# EasyEDA Pro project 16V2_EDA.eprj

# Schematic Schematic2
Board Name: Board1; Create Date: 2024-11-21; Page Name: P1; Project Name: 16V2_EDA; Schematic Name: Schematic2; Update Date: 2024-12-05; Company: 嘉立创EDA; Page Size: A4; Version: V1.0
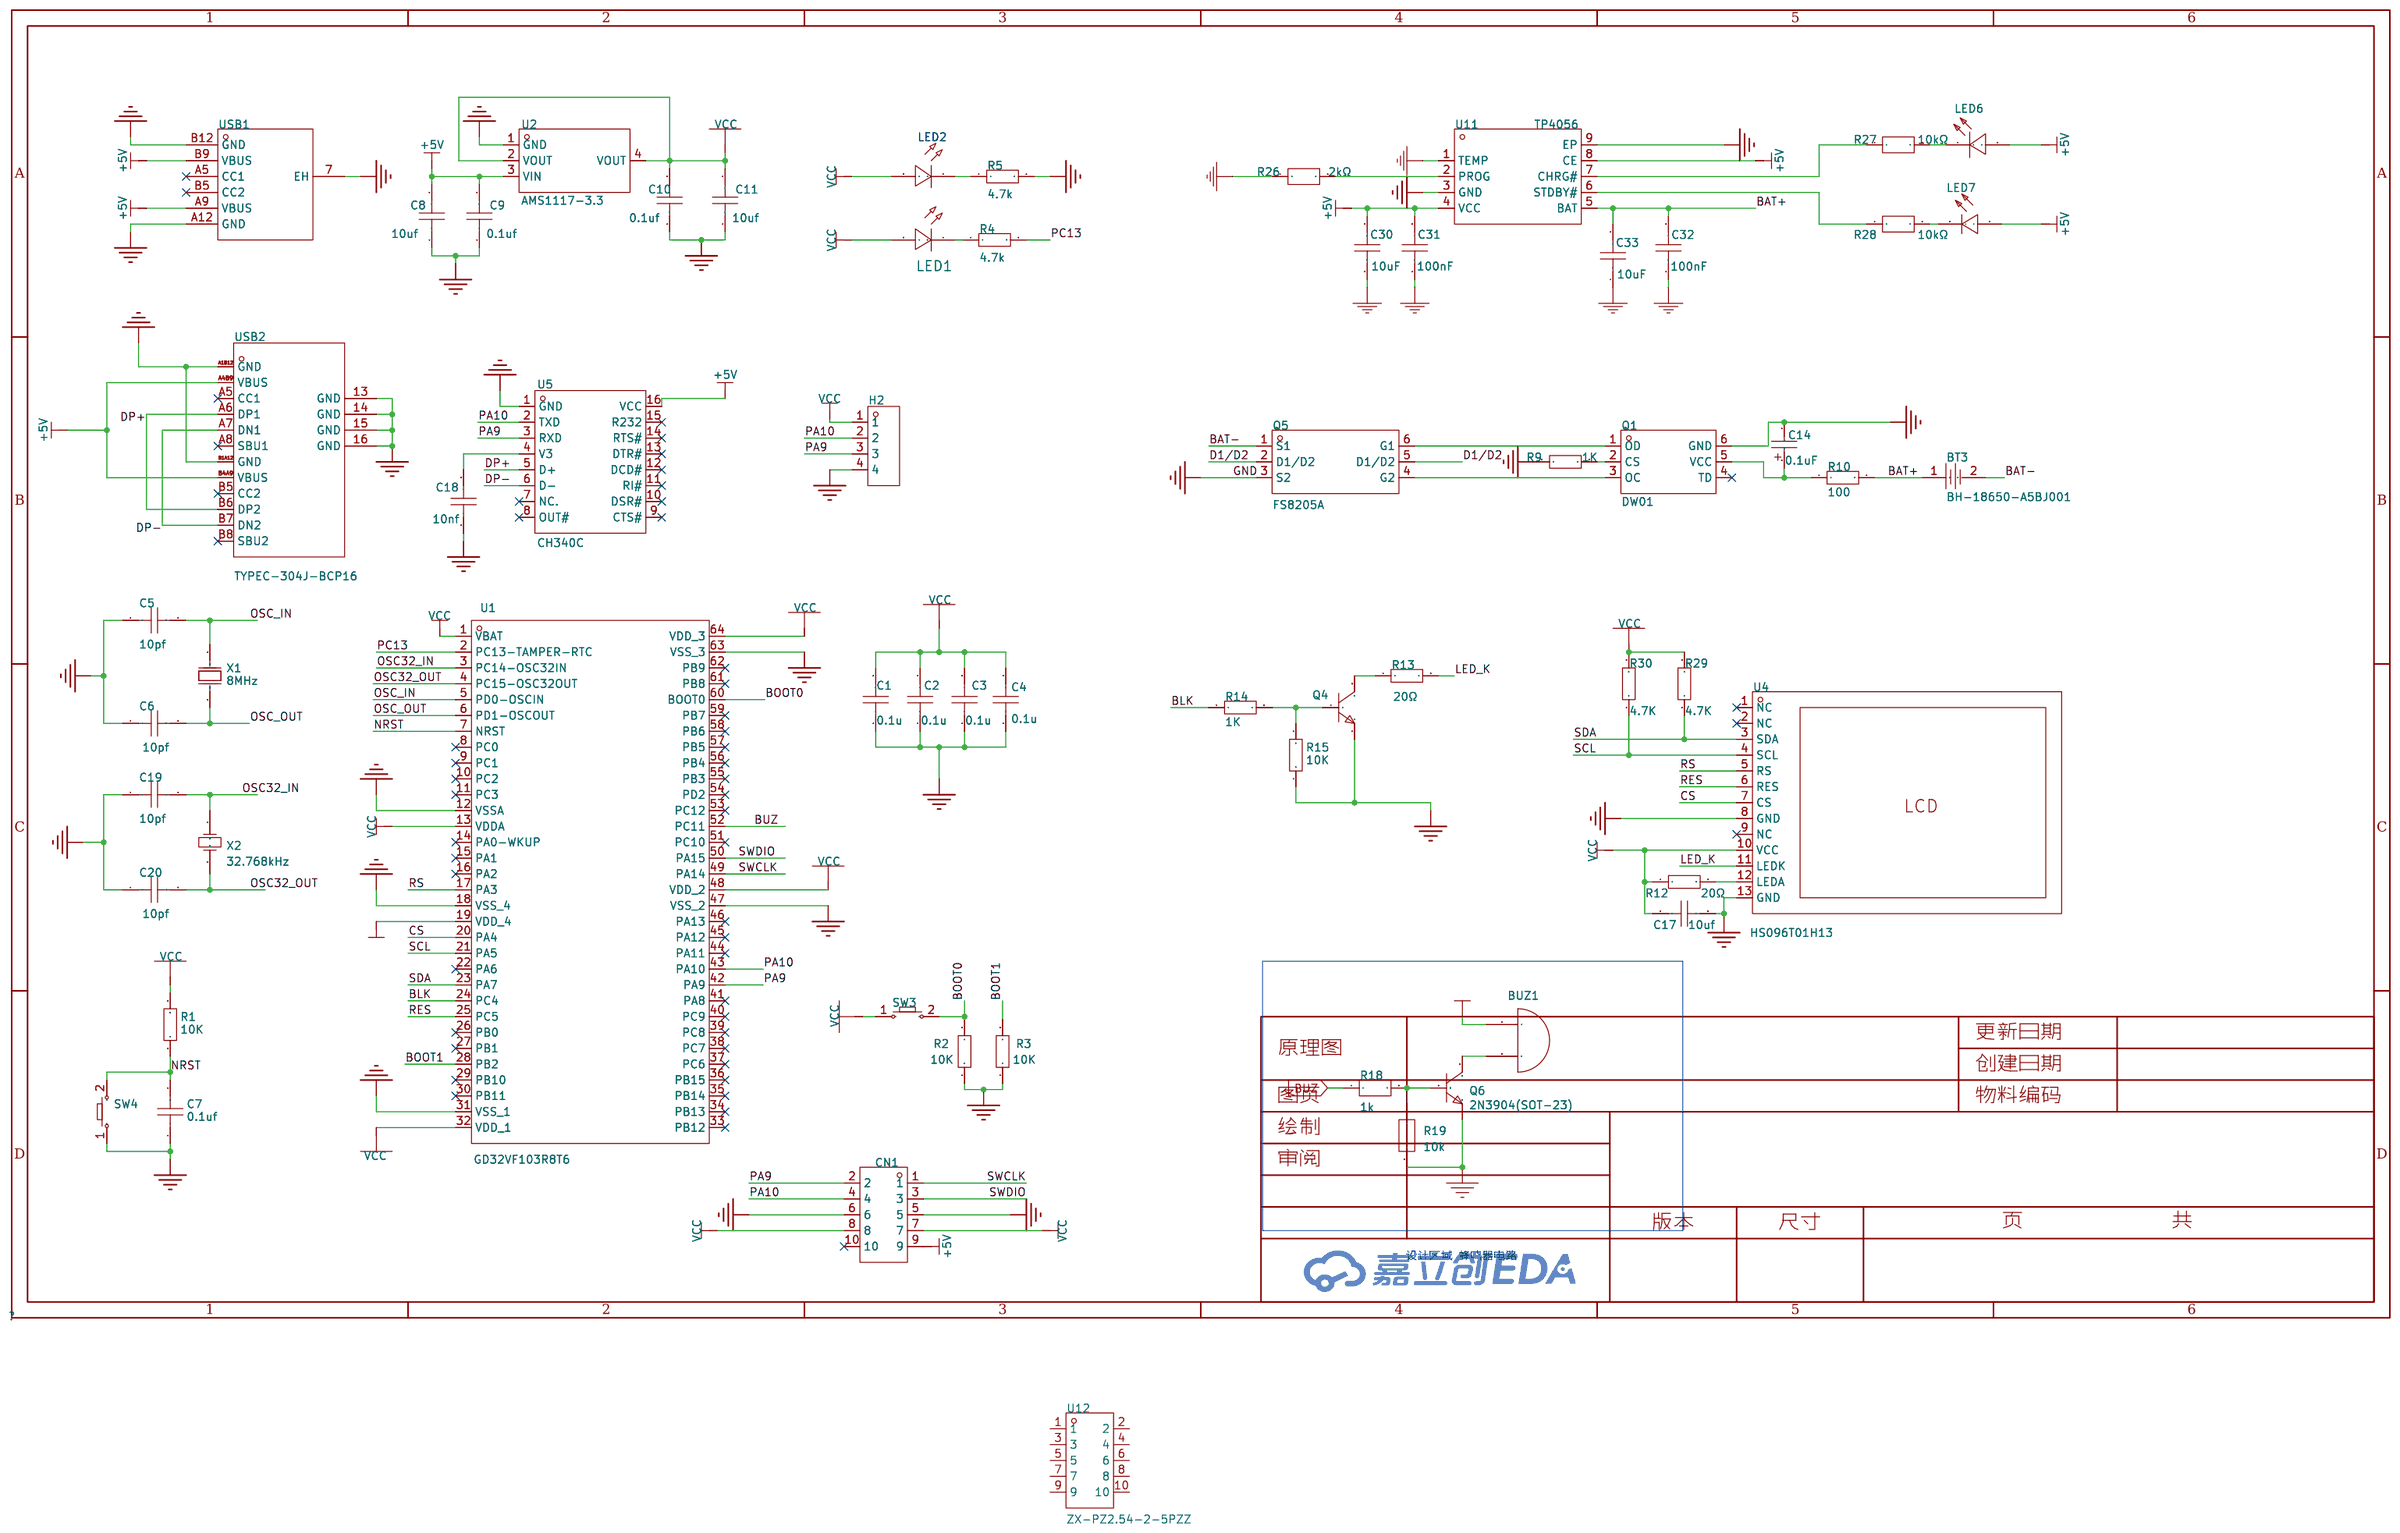
[diagram p0: schematic sheet]

## Parts
BT3  BH-18650-A5BJ001  [BAT-SMD_CR1220-2ZX]
BUZ1  BUZ1  [BUZ]
C1  0.1u  [C0603]
C2  0.1u  [C0603]
C3  0.1u  [C0603]
C4  0.1u  [C0603]
C5  10pf  [C0603]
C6  10pf  [C0603]
C7  0.1uf  [C0603]
C8  10uf  [C0603]
C9  0.1uf  [C0603]
C10  0.1uf  [C0603]
C11  10uf  [C0603]
C14  0.1uF  [C0603]
C17  10uf  [C0603]
C18  10nf  [C0603]
C19  10pf  [C0603]
C20  10pf  [C0603]
C30  10uF  [C0603]
C31  100nF  [C0603]
C32  100nF  [C0603]
C33  10uF  [C0603]
CN1  ZX-PZ2.54-2-5PZZ  [HDR-TH_10P-P2.54-V-M-R2-C5-S2.54]
H2  2.54-1*4P反弯排针  [HDR-TH_4P-P2.54-H-M-W10.4]
LED1  -  [LED_0603]
LED2  -  [LED_0603]
LED6  KT-0603R  [LED0603-RD]
LED7  NCD0603B1  [LED0603-RD]
Q1  DW01  [SOT-23-6_L2.9-W1.6-P0.95-LS2.8-BR]
Q4  -  [S8050_SOT-23]
Q5  FS8205A  [SOT-23-6_L2.9-W1.6-P0.95-LS2.8-BR]
Q6  2N3904(SOT-23)  [sot-23-3_l2.9-w1.3-p1.90-ls2.4-br]
R1  10K  [R0603]
R2  10K  [R0603]
R3  10K  [R0603]
R4  4.7k  [R0603]
R5  4.7k  [R0603]
R9  1K  [R0603]
R10  100  [R0603]
R12  20Ω  [R0603]
R13  20Ω  [R0603]
R14  1K  [R0603]
R15  10K  [R0603]
R18  1k  [R0603]
R19  10k  [R0603]
R26  2kΩ  [R0603]
R27  10kΩ  [R0603]
R28  10kΩ  [R0603]
R29  4.7K  [R0603]
R30  4.7K  [R0603]
SW3  -  [Key_SMD_3x4x2]
SW4  -  [Key_SMD_3x4x2]
U1  GD32VF103R8T6  [LQFP-64_L10.0-W10.0-P0.50-LS12.0-BL]
U2  AMS1117-3.3  [SOT-223-3_L6.5-W3.4-P2.30-LS7.0-BR]
U4  HS096T01H13  [LCD-SMD_HS096T01H13]
U5  CH340C  [SOP-16_L10.0-W3.9-P1.27-LS6.0-BL]
U11  TP4056  [esop-8_l4.9-w3.9-p1.27-ls6.0-bl-ep]
U12  ZX-PZ2.54-2-5PZZ  [HDR-TH_10P-P2.54-V-M-R2-C5-S2.54]
USB1  TYPE-C 6P  [TYPE-C-SMD_TYPE-C-6P]
USB2  TYPEC-304J-BCP16  [USB-C-SMD_TYPEC-304J-BCP16]
X1  8MHz  [HC-49S_L10.8-W4.5-P4.88]
X2  32.768kHz  [CRYSTAL-SMD_L3.2-W1.5]

## Library data of the parts
BT3 = BH-18650-A5BJ001: BHNi DIP 适用电池18650电芯//电池底座/卧式DIP 电池盒/电池座 材质：PP  镀镍 ，; Supplier Part: C5383220; Manufacturer: MYOUNG(美阳); Supplier Footprint: 插件; Datasheet: https://atta.szlcsc.com/upload/public/pdf/source/20230321/F45C04DF2D4E00D187312CBE97BD9F67.pdf; Supplier: LCSC
BUZ1 = BUZ1
C1-C11 C17-C20 = CAP_0603: Supplier Footprint: 0603
C14 = C_Ele_SMD_3x5.4mm: Supplier Footprint: SMD,3x5.4mm
C30 C33 = CL21A106KAYNNNE_C15850: 容值:10uF;精度:±10%;额定电压:25V;材质(温度系数):X5R;; LCSC Part Name: 10uF ±10% 25V; Supplier Part: C15850; Manufacturer: SAMSUNG(三星); Manufacturer Part: CL21A106KAYNNNE; Supplier Footprint: 0805; JLCPCB Part Class: Basic Part; Datasheet: https://atta.szlcsc.com/upload/public/pdf/source/20160218/1457707763339.pdf; Supplier: LCSC; Tolerance: ±10%; Voltage Rated: 25V; Temperature Coefficient: X5R
C31 C32 = CC0603KRX7R9BB104: 容值:100nF;精度:±10%;额定电压:50V;材质(温度系数):X7R;; LCSC Part Name: 100nF ±10% 50V; Supplier Part: C14663; Manufacturer: YAGEO(国巨); Supplier Footprint: 0603; JLCPCB Part Class: 基础库; Datasheet: https://atta.szlcsc.com/upload/public/pdf/source/20180910/C282072_33301C7F631E79921B82A8DAC6BCC5B3.pdf; Supplier: LCSC; Tolerance: ±10%; Voltage Rated: 50V; Temperature Coefficient: X7R
CN1 = ZX-PZ2.54-2-5PZZ: 插针结构:2x5P;间距:2.54mm;行距:2.54mm;圆针/方针:方针;安装类型:直插;排数:双排;总PIN位数:10P;额定电流:3A;额定电压:1kV;配合针长度:6mm;塑高:2.5mm;端接针长度:3mm;触头材质:黄铜;触头镀层:金;工作温度范围:-40℃~+105℃;焊接温度(最大值):-;颜色:黑色;; LCSC Part Name: 2x5P 间距:2.54mm 方针 直插; Supplier Part: C7501276; Manufacturer: Megastar(兆星); Supplier Footprint: 插件,P=2.54mm; JLCPCB Part Class: Extended Part; Datasheet: https://atta.szlcsc.com/upload/public/pdf/source/20231122/7DD2FA5A7FDBC10CDDB6051CB6BC6AD1.pdf; Supplier: LCSC; Pin Structure: 2x5P; Pitch: 2.54mm; Row Spacing: 2.54mm; Circluar Pins/Square Pins: 方针; Mounting Type: 直插; Number of Rows: 双排; Number of Pins: 10P; Current Rating (Max): 3A; Voltage Rating (Max): 1kV; Length of Mating Pin: 6mm; Insulation Height: 2.5mm; Length of End Connection Pin: 3mm; Contact Material: 黄铜; Contact Plating: 金; Operating Temperature Range: -40℃~+105℃; Color: 黑色; Check: false
H2 = 2.54-1*4P反弯排针: 插针结构:1x4P;间距:2.54mm;行距:-;圆针/方针:方针;安装类型:弯插;排数:单排;总PIN位数:4P;额定电流:3A;额定电压:-;配合针长度:6mm;塑高:-;端接针长度:-;触头材质:-;触头镀层:-;工作温度范围:-55℃~+105℃;颜色:黑色;; LCSC Part Name: 间距:2.54mm 1x4P 弯插 方针; Supplier Part: C91552; Manufacturer: BOOMELE(博穆精密); Supplier Footprint: 弯插,P=2.54mm; JLCPCB Part Class: 扩展库; Datasheet: https://atta.szlcsc.com/upload/public/pdf/source/20190508/C74252_03DDEC4696EE17172E44B96636392962.pdf; Supplier: LCSC; Pin Structure: 1x4P; Pitch: 2.54mm; Circluar Pins/Square Pins: 方针; Mounting Type: 弯插; Number of Rows: 单排; Number of Pins: 4P; Current Rating (Max): 3A; Length of Mating Pin: 6mm; Operating Temperature Range: -55℃~+105℃; Color: 黑色
LED1 = LED_0603-R: Supplier Footprint: 0603
LED2 = LED_0603-G: Supplier Footprint: 0603
LED6 = KT-0603R: Supplier: LCSC; Manufacturer: KENTO; Supplier Part: C2286; JLCPCB Part Class: Basic Part
LED7 = NCD0603B1: 发光颜色:蓝色;正向电压(VF):2.6V~3.6V;功率:72mW;正向电流:10mA;主波长:463nm~475nm;透镜颜色:无色透明透镜;发光强度:80mcd~220mcd;发光角度:130°;工作温度:-30℃~+85℃;; Supplier Part: C84266; Manufacturer: 国星光电; Supplier Footprint: 0603; JLCPCB Part Class: Extended Part; Datasheet: https://atta.szlcsc.com/upload/public/pdf/source/20200820/C84266_6A3CDBEFA72C6CAD68EDA53474ADAE6C.pdf; Supplier: LCSC; Emitted Color: 蓝色; Forward Voltage (VF): 2.6V~3.6V; Power Dissipation: 72mW; Forward Current: 10mA; Dominant Wavelength: 463nm~475nm; Lens Color: 无色透明透镜; Luminous Intensity: 80mcd~220mcd; Viewing Angle: 130°; Operating Temperature: -30℃~+85℃
Q1 = DW01_C181096: Supplier Part: C181096; Manufacturer: Hottech(合科泰); Supplier Footprint: SOT-23-6; Datasheet: https://atta.szlcsc.com/upload/public/pdf/source/20231007/94AC323C2B651AEA18C7FC8F0156E5A9.pdf; Supplier: LCSC
Q4 = S8050_SOT_NPN: Supplier Footprint: SOT-23
Q5 = FS8205A: 类型:2个N沟道;漏源电压(Vdss):20V;连续漏极电流(Id):6A;功率(Pd):1.5W;导通电阻(RDS(on)@Vgs,Id):19.5mΩ@4.5V,3A;阈值电压(Vgs(th)@Id):700mV@250uA;; LCSC Part Name: 2个N沟道 耐压:20V 电流:6A; Supplier Part: C2830320; Manufacturer: TECH PUBLIC(台舟); Supplier Footprint: SOT-23-6; JLCPCB Part Class: 扩展库; Datasheet: https://atta.szlcsc.com/upload/public/pdf/source/20210810/F53B6D4E8755A1F8E11BAF814CE98E6A.pdf; Supplier: LCSC; Type: 2个N沟道; Drain Source Voltage (Vdss): 20V; Continuous Drain Current (Id): 6A; Power Dissipation (Pd): 1.5W; Drain Source On Resistance (RDS(on)@Vgs,Id): 19.5mΩ@4.5V,3A; Gate Threshold Voltage (Vgs(th)@Id): 700mV@250uA; Total Gate Charge (Qg@Vgs): 5.7nC@10V; Input Capacitance (Ciss@Vds): 466pF@10V; Reverse Transfer Capacitance (Crss@Vds): 58pF@10V; Operating Temperature: -55℃~+150℃@(Tj)
Q6 = 2n3904S-RTK/PS: Supplier: LCSC; Manufacturer: KEC; Supplier Part: C18536; Paste Type: SOT-23
R1-R5 R9 R10 R12-R15 R29 R30 = Res_0603: Supplier Footprint: 0603
R18 = 1k
R19 = 10k
R26 = 0603WAF2001T5E: 电阻类型:厚膜电阻;阻值:2kΩ;精度:±1%;功率:100mW;最大工作电压:75V;温度系数:±100ppm/℃;; LCSC Part Name: 2kΩ ±1% 100mW 厚膜电阻; Supplier Part: C22975; Manufacturer: UNI-ROYAL(厚声); Supplier Footprint: 0603; JLCPCB Part Class: Basic Part; Datasheet: https://atta.szlcsc.com/upload/public/pdf/source/20200306/C422600_1E6D84923E4A46A82E41ADD87F860B5C.pdf; Supplier: LCSC; Type: 厚膜电阻; Tolerance: ±1%; Power(Watts): 100mW; Overload Voltage (Max): 75V; Temperature Coefficient: ±100ppm/℃; Operating Temperature Range: -55℃~+155℃
R27 R28 = 0603WAF1002T5E: 电阻类型:厚膜电阻;阻值:10kΩ;精度:±1%;功率:100mW;最大工作电压:75V;温度系数:±100ppm/℃;; LCSC Part Name: 厚膜电阻 10kΩ ±1% 100mW; Supplier Part: C25804; Manufacturer: UNI-ROYAL(厚声); Supplier Footprint: 0603; JLCPCB Part Class: Basic Part; Datasheet: https://atta.szlcsc.com/upload/public/pdf/source/20200306/C422600_1E6D84923E4A46A82E41ADD87F860B5C.pdf; Supplier: LCSC; Type: 厚膜电阻; Tolerance: ±1%; Power(Watts): 100mW; Overload Voltage (Max): 75V; Temperature Coefficient: ±100ppm/℃; Operating Temperature Range: -55℃~+155℃
SW3 SW4 = Key_SMD_3x4x2: Supplier Footprint: SMD
U1 = GD32VF103R8T6: CPU内核:RISC-V;程序存储容量:64KB;RAM总容量:20KB;GPIO端口数量:51;工作电压范围:-;CPU最大主频:108MHz;程序存储器类型:FLASH;; Supplier Part: C5178402; Manufacturer: GigaDevice(兆易创新); Supplier Footprint: LQFP-64(10x10); Supplier: LCSC; CPU Core: RISC-V; Program Storage Size: 64KB; RAM Size: 20KB; GPIO Ports Number: 51; CPU Maximum Speed: 108MHz; Program Memory Type: FLASH; ADC (Bit): 12bit; DAC (Bit): 12bit; 16Bit Timer: 7; CAN: 2; UART/USART: 5; I2C: 2; I2S: 2; SPI: 3; Universal Serial Bus: 有; Peripheral/Function: 看门狗；RTC实时时钟; Watchdog: 有; Real-Time Clock: 有
U2 = AMS1117-3.3_C6186: 输出类型:固定;最大输入电压:-;输出电压:3.3V;最大输出电流:1A;电源纹波抑制比(PSRR):72dB@(120Hz);输出极性:正极;; LCSC Part Name: 输出3.3V 1A; Supplier Part: C6186; Manufacturer: AMS; Supplier Footprint: SOT-223; JLCPCB Part Class: 基础库; Datasheet: https://atta.szlcsc.com/upload/public/pdf/source/20180727/C6186_7A095716F0823C02F1997A905E26C086.pdf; Supplier: LCSC; Output Type: 固定; Output Voltage: 3.3V; MAX Output Current: 1A; Power Supply Rejection Ratio (PSRR): 72dB@(120Hz); Dropout Voltage: 1.3V@(800mA); Output Polarity: 正极; Number of Outputs: 1
U4 = HS096T01H13: 主控芯片:ST7735;尺寸(inch):0.96;; LCSC Part Name: 0.96寸 0.96寸800x160(RGB)彩色SPI串口TFT液晶显示屏; Supplier Part: C18198246; Manufacturer: HS(汉昇); Datasheet: https://atta.szlcsc.com/upload/public/pdf/source/20230921/67AD52EDFD5E8BFFA1AE424F3A3F761A.pdf; Supplier: LCSC; Main Control Chip: ST7735; Size: 0.96; Operating Temperature: -20℃~+70℃
U5 = CH340C: 应用功能:收发器;接口协议:USB 2.0;数据速率:2Mbps;; LCSC Part Name: CH340C USB转串口芯片 CH340; Supplier Part: C84681; Manufacturer: WCH(南京沁恒); Supplier Footprint: SOP-16; JLCPCB Part Class: 扩展库; Datasheet: https://atta.szlcsc.com/upload/public/pdf/source/20200819/C84681_ADBED554CE321879DBD6B1D06488689C.pdf; Supplier: LCSC; Applications Function: 收发器; Protocol: USB 2.0; Supply Voltage: 3.3V；5V; Data Rate: 2Mbps
U11 = TP4056_C725790: Supplier: LCSC; Supplier Part: C725790; Manufacturer: UMW(友台半导体); JLCPCB Part Class: Extended Part
U12 = ZX-PZ2.54-2-5PZZ: 插针结构:2x5P;间距:2.54mm;行距:2.54mm;圆针/方针:方针;安装类型:直插;排数:双排;总PIN位数:10P;额定电流:3A;额定电压:1kV;配合针长度:6mm;塑高:2.5mm;端接针长度:3mm;触头材质:黄铜;触头镀层:金;工作温度范围:-40℃~+105℃;焊接温度(最大值):-;颜色:黑色;; LCSC Part Name: 2x5P 间距:2.54mm 方针 直插; Supplier Part: C7501276; Manufacturer: Megastar(兆星); Supplier Footprint: 插件,P=2.54mm; JLCPCB Part Class: Extended Part; Datasheet: https://atta.szlcsc.com/upload/public/pdf/source/20231122/7DD2FA5A7FDBC10CDDB6051CB6BC6AD1.pdf; Supplier: LCSC; Pin Structure: 2x5P; Pitch: 2.54mm; Row Spacing: 2.54mm; Circluar Pins/Square Pins: 方针; Mounting Type: 直插; Number of Rows: 双排; Number of Pins: 10P; Current Rating (Max): 3A; Voltage Rating (Max): 1kV; Length of Mating Pin: 6mm; Insulation Height: 2.5mm; Length of End Connection Pin: 3mm; Contact Material: 黄铜; Contact Plating: 金; Operating Temperature Range: -40℃~+105℃; Color: 黑色
USB1 = TYPE-C 6P: 连接器类型:Type-C;标准:-;公母:母;端口数量:1;触点数量:6P;安装方式:卧贴;额定电流 - 电源:-;工作温度范围:-40℃~+85℃;; LCSC Part Name: Type-C 母 卧贴; Supplier Part: C456012; Manufacturer: SHOU HAN(首韩); Supplier Footprint: SMD; JLCPCB Part Class: 扩展库; Datasheet: https://atta.szlcsc.com/upload/public/pdf/source/20201203/C456012_B13F72044DF846EDBE9BDD0D1D3CD166.pdf; Supplier: LCSC; Connector Type: Type-C; Gender: 母; Number of Ports: 1; Number of Contacts: 6P; Mounting Style: 卧贴; Operating Temperature Range: -40℃~+85℃
USB2 = TYPEC-304J-BCP16: 连接器类型:Type-C;标准:USB 3.1;公母:母;端口数量:1;触点数量:16P;安装方式:卧贴;额定电流 - 电源:5A;工作温度范围:-40℃~+85℃;焊接温度(最大值):260℃;; LCSC Part Name: Type-C 母 卧贴; Supplier Part: C2835315; Manufacturer: XUNPU(讯普); Supplier Footprint: SMD; Datasheet: https://atta.szlcsc.com/upload/public/pdf/source/20210528/C2835315_A76BD3CF9329D12B6041421AD23BFD66.pdf; Supplier: LCSC; Connector Type: Type-C; Standard: USB 3.1; Gender: 母; Number of Ports: 1; Number of Contacts: 16P; Mounting Style: 卧贴; Current Rating - Power (Max): 5A; Operating Temperature Range: -40℃~+85℃; Soldering Temperature(Max): 260℃
X1 = X49SM8MSD2SC: 晶振类型:贴片晶振;频率:8MHz;常温频差:±20ppm;外接负载电容:20pF;频率稳定度(全温):±30ppm;; LCSC Part Name: 8MHz ±20ppm 20pF; Supplier Part: C12674; Manufacturer: YXC(扬兴晶振); Supplier Footprint: HC-49S-SMD; JLCPCB Part Class: 基础库; Datasheet: https://atta.szlcsc.com/upload/public/pdf/source/20240329/3EBF42EBCAB50CA65B6FA9D7CFA1955A.pdf; Supplier: LCSC; Crystal Type: 贴片晶振; Normal temperature Frequency Tolerance: ±20ppm; External load capacitor: 20pF; Frequency Stability(Full temperature range): ±30ppm; Operating Temperature: -20℃~+70℃
X2 = X308032768KGB2SC: 晶振类型:直插晶振;频率:32.768kHz;常温频差:±10ppm;外接负载电容:12.5pF;频率稳定度(全温):-;; LCSC Part Name: 32.768kHz ±10ppm 12.5pF YT-38; Supplier Part: C52082; Manufacturer: YXC(扬兴晶振); Supplier Footprint: DT-38; JLCPCB Part Class: Extended Part; Datasheet: https://atta.szlcsc.com/upload/public/pdf/source/20240329/231E1A1EB7C875CD193DBE6664A3DE3A.pdf; Supplier: LCSC; Crystal Type: 直插晶振; Normal temperature Frequency Tolerance: ±10ppm; External load capacitor: 12.5pF; Operating Temperature: -20℃~+70℃

## Nets
+5V: C8.2 C9.2 C30.2 C31.2 CN1.9 LED6.2(A) LED7.2(+) U2.3(VIN) U5.16(VCC) U11.4(VCC) U11.8(CE) USB1.A9(VBUS) USB1.B9(VBUS) USB2.A4B9(VBUS) USB2.B4A9(VBUS)
GND: C1.1 C2.1 C3.1 C4.1 C5.1 C6.1 C7.1 C8.1 C9.1 C10.1 C11.1 C14.2 C17.2 C18.1 C19.1 C20.1 C30.1 C31.1 C32.1 C33.1 CN1.5 CN1.6 H2.4 Q1.6(GND) Q4.2 Q5.3(S2) Q6.1(E) R2.1 R3.1 R5.2 R9.1 R15.1 R19.2 R26.1 SW4.1 U1.12(VSSA) U1.18(VSS_4) U1.31(VSS_1) U1.47(VSS_2) U1.63(VSS_3) U2.1(GND) U4.8(GND) U4.13(GND) U5.1(GND) U11.1(TEMP) U11.3(GND) U11.9(EP) USB1.7(EH) USB1.A12(GND) USB1.B12(GND) USB2.13(GND) USB2.14(GND) USB2.15(GND) USB2.16(GND) USB2.A1B12(GND) USB2.B1A12(GND)
VCC: BUZ1.1(A) C1.2 C2.2 C3.2 C4.2 C10.2 C11.2 C17.1 CN1.7 CN1.8 H2.1 LED1.2(A) LED2.2(A) R1.2 R12.1 R29.2 R30.2 SW3.1 U1.1(VBAT) U1.13(VDDA) U1.19(VDD_4) U1.32(VDD_1) U1.48(VDD_2) U1.64(VDD_3) U2.2(VOUT) U2.4(VOUT) U4.10(VCC)
BAT+: BT3.1 C32.2 C33.2 R10.2 U11.5(BAT)
BAT-: BT3.2 Q5.1(S1)
BLK: R14.1 U1.24(PC4)
BOOT0: R2.2 SW3.2 U1.60(BOOT0)
BOOT1: R3.2 U1.28(PB2)
BUZ: R18.1 U1.52(PC11)
CS: U1.20(PA4) U4.7(CS)
D1/D2: Q5.2(D1/D2) Q5.5(D1/D2)
DP+: U5.5(D+) USB2.A6(DP1) USB2.B6(DP2)
DP-: U5.6(D-) USB2.A7(DN1) USB2.B7(DN2)
LED_K: R13.2 U4.11(LEDK)
NRST: C7.2 R1.1 SW4.2 U1.7(NRST)
OSC32_IN: C19.2 U1.3(PC14-OSC32IN) X2.1(OSC1)
OSC32_OUT: C20.2 U1.4(PC15-OSC32OUT) X2.2(OSC2)
OSC_IN: C5.2 U1.5(PD0-OSCIN) X1.1(OSC1)
OSC_OUT: C6.2 U1.6(PD1-OSCOUT) X1.2(OSC2)
PA9: CN1.2 H2.3 U1.42(PA9) U5.3(RXD)
PA10: CN1.4 H2.2 U1.43(PA10) U5.2(TXD)
PC13: R4.2 U1.2(PC13-TAMPER-RTC)
RES: U1.25(PC5) U4.6(RES)
RS: U1.17(PA3) U4.5(RS)
SCL: R30.1 U1.21(PA5) U4.4(SCL)
SDA: R29.1 U1.23(PA7) U4.3(SDA)
SWCLK: CN1.1 U1.49(PA14)
SWDIO: CN1.3 U1.50(PA15)
$1N3244: LED1.1(C) R4.1
$1N3260: LED2.1(C) R5.1
$1N3280: Q1.2(CS) R9.2
$1N3281: C14.1 Q1.5(VCC) R10.1
$1N3299: R12.2 U4.12(LEDA)
$1N3320: Q4.3 R13.1
$1N3321: Q4.1 R14.2 R15.2
$1N3342: C18.2 U5.4(V3)
$1N3364: R26.2 U11.2(PROG)
$1N3367: R27.1 U11.7(CHRG#)
$1N3368: LED6.1(K) R27.2
$1N3369: LED7.1(-) R28.2
$1N3370: R28.1 U11.6(STDBY#)
$1N3387: Q1.1(OD) Q5.6(G1)
$1N3388: Q1.3(OC) Q5.4(G2)
$1N22478: Q6.2(B) R18.2 R19.1
$1N22491: BUZ1.2(B) Q6.3(C)

Not connected (* = marked no-connect by the designer): CN1 10*; Q1 4(TD)*; U1 8(PC0)* 9(PC1)* 10(PC2)* 11(PC3)* 14(PA0-WKUP)* 15(PA1)* 16(PA2)* 22(PA6)* 26(PB0)* 27(PB1)* 29(PB10)* 30(PB11)* 33(PB12)* 34(PB13)* 35(PB14)* 36(PB15)* 37(PC6)* 38(PC7)* 39(PC8)* 40(PC9)* 41(PA8)* 44(PA11)* 45(PA12)* 46(PA13)* 51(PC10)* 53(PC12)* 54(PD2)* 55(PB3)* 56(PB4)* 57(PB5)* 58(PB6)* 59(PB7)* 61(PB8)* 62(PB9)*; U4 1(NC)* 2(NC)* 9(NC)*; U5 7(NC.)* 8(OUT#)* 9(CTS#)* 10(DSR#)* 11(RI#)* 12(DCD#)* 13(DTR#)* 14(RTS#)* 15(R232)*; U12 1 2 3 4 5 6 7 8 9 10; USB1 A5(CC1)* B5(CC2)*; USB2 A5(CC1)* A8(SBU1)* B5(CC2)* B8(SBU2)*

## Notes on the sheet
- 设计区域 蜂鸣器电路

# Board PCB
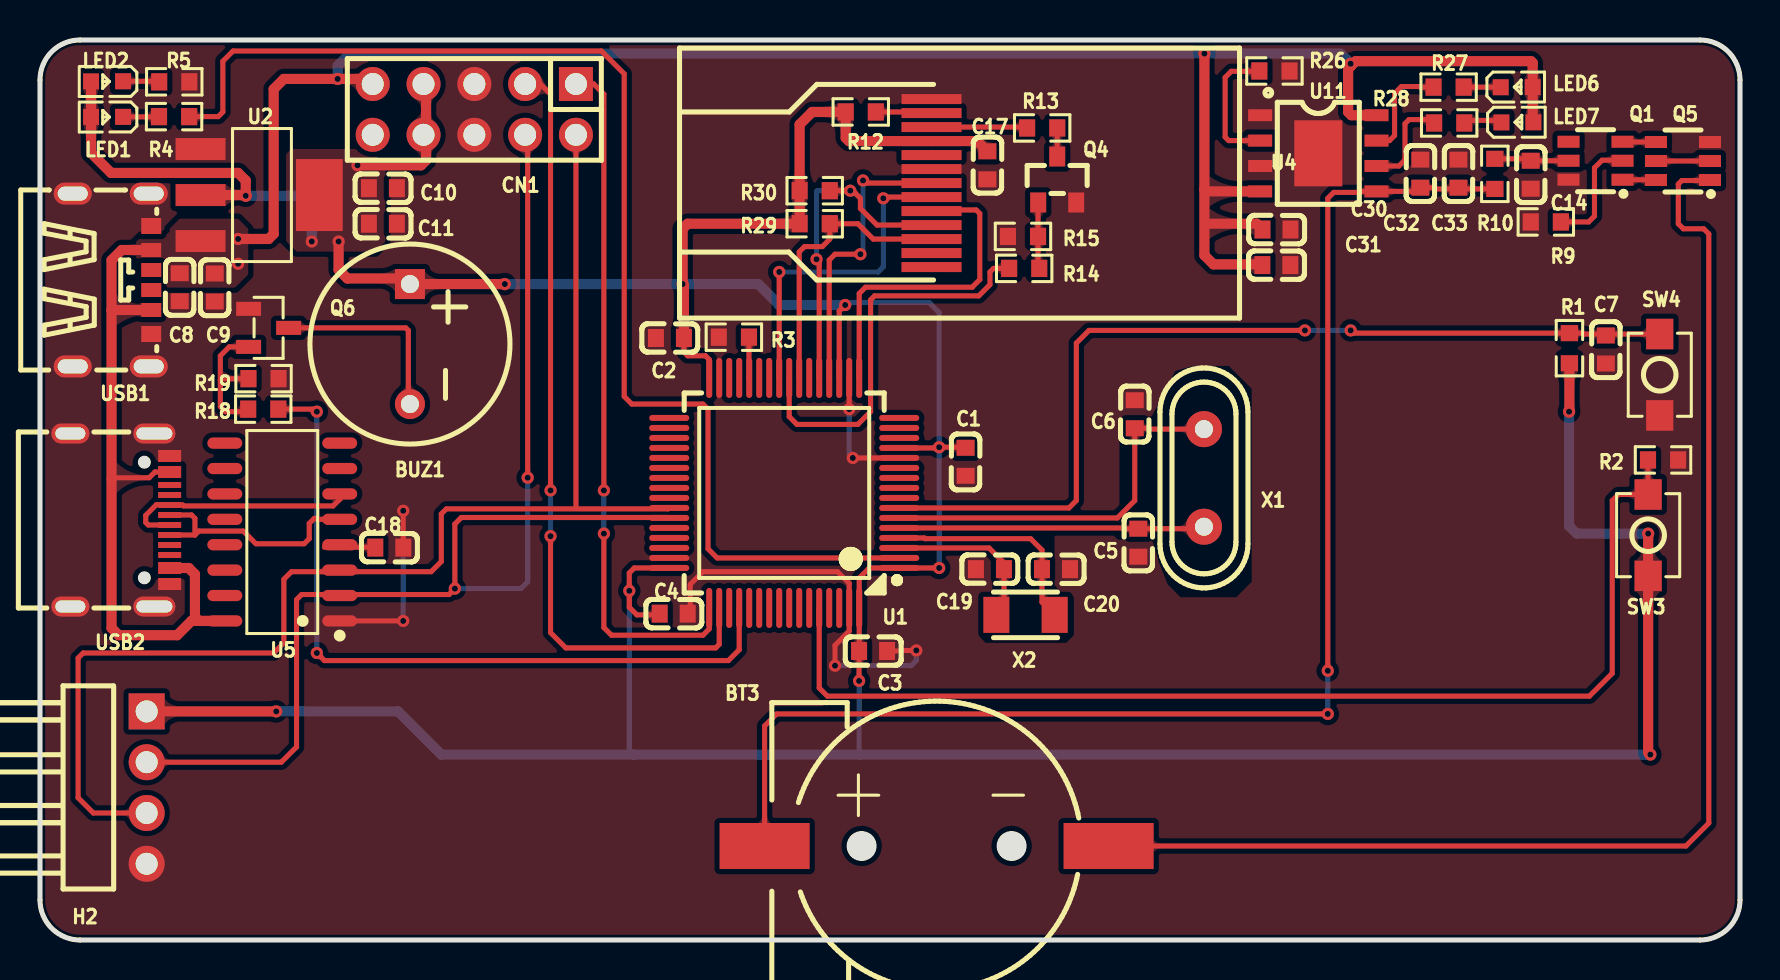
[diagram p1: board, top side]
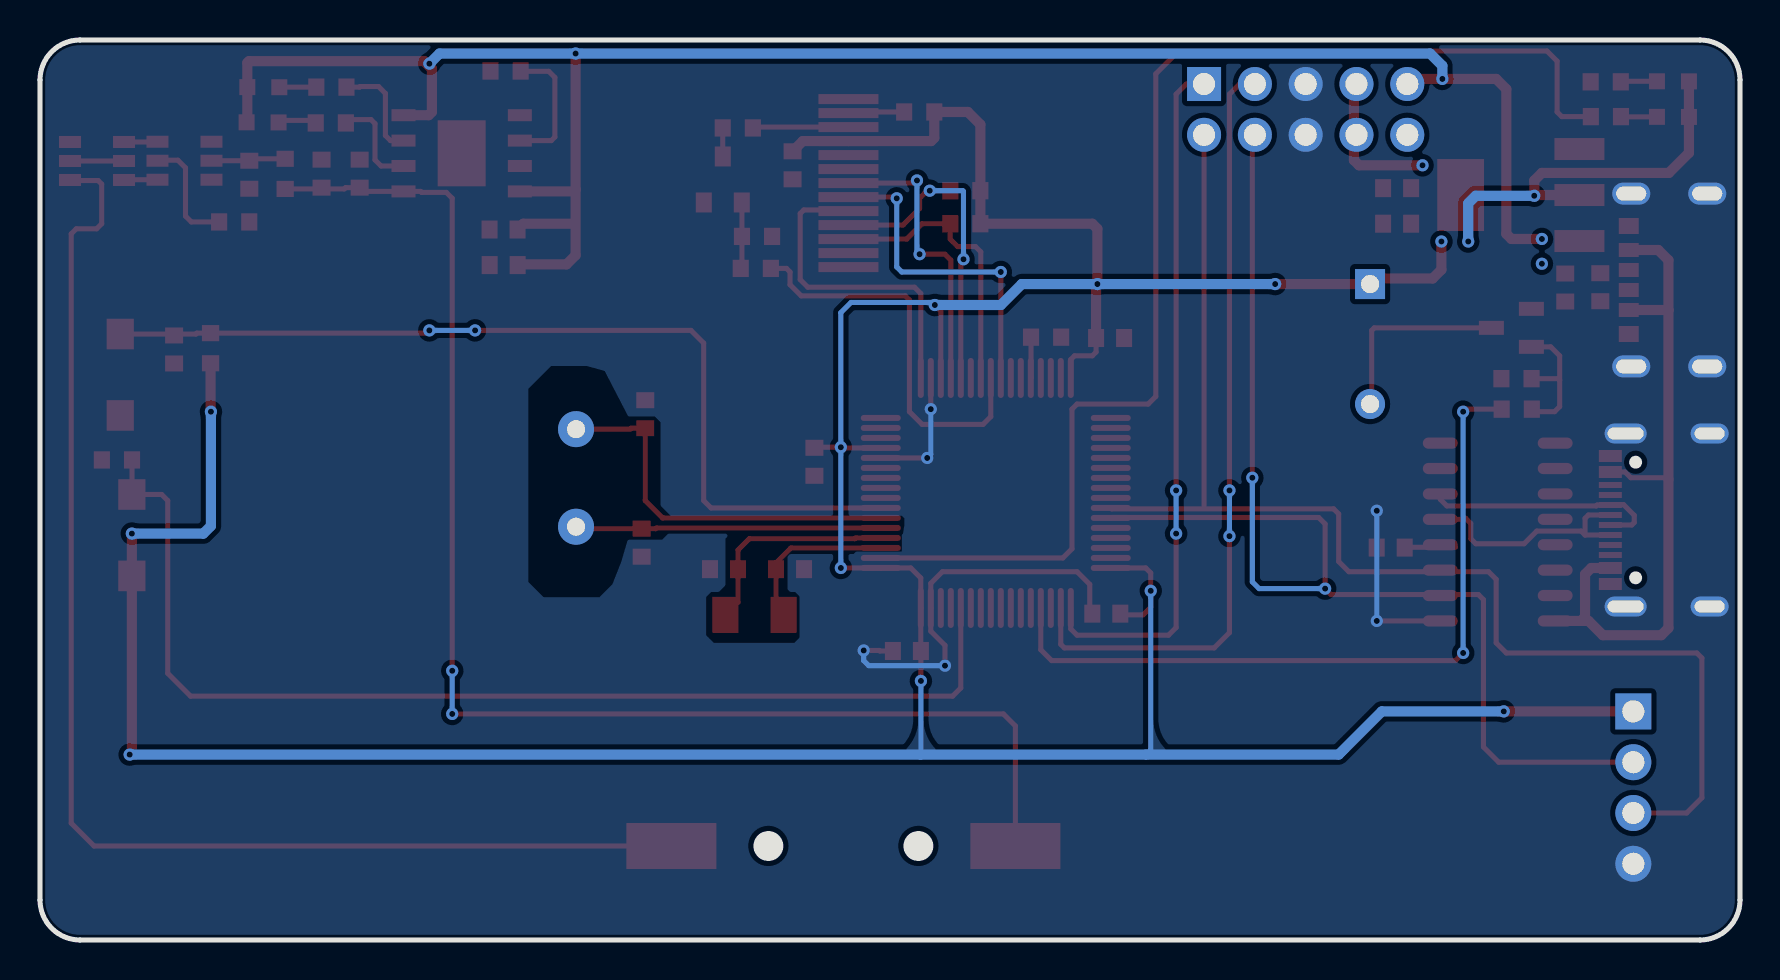
[diagram p2: board, bottom side, seen from below]

Outline 85 x 45 mm; copper layers: Top Layer, Bottom Layer. Coordinates in mm from the lower left corner of the outline.
Outline path: 0,43 0,2 arc(0.59,0.59) 2,0 83,0 arc(84.41,0.59) 85,2 85,43 arc(84.41,44.41) 83,45 2,45 arc(0.59,44.41) 0,43
Stack: Top Layer 0.035mm / Dielectric1 1.51mm FR4 er 4.5 / Bottom Layer 0.035mm

## Design rules (mm)
net DP+: DP1
net DP-: DP1
template: 自定义配置
spacing copperThickness1oz (default): track to track 0.178, other pairs 0.152 to 0.203
spacing copperThickness2oz: track to track 0.203, other pairs 0.152 to 0.3
track width copperThickness1oz (default): min 0.254, default 0.254, max 2.54
track width copperThickness2oz: min 0.203, default 0.254, max 2.54
differential pair differentialPair (default): width min 0.254, default 0.254, max 2.54; gap min 0.152, default 0.152
via viaSize (default): diameter min 0.61, default 0.61, max 0.61; hole min 0.305, default 0.305, max 0.305

## Placement (name value [footprint] x y rotation side)
BT3  BH-18650-A5BJ001  [BAT-SMD_CR1220-2ZX]  44.83 4.7 0 top
BUZ1  BUZ1  [BUZ]  18.5 32.8 270 top
C1  0.1u  [C0603]  46.28 23.91 90 top
C2  0.1u  [C0603]  31.5 30.1 0 top
C3  0.1u  [C0603]  41.65 14.45 180 top
C4  0.1u  [C0603]  31.69 16.32 180 top
C5  10pf  [C0603]  54.92 19.86 90 top
C6  10pf  [C0603]  54.74 26.29 270 top
C7  0.1uf  [C0603]  78.29 29.53 90 top
C8  10uf  [C0603]  6.98 32.64 90 top
C9  0.1uf  [C0603]  8.74 32.62 90 top
C10  0.1uf  [C0603]  17.14 37.59 180 top
C11  10uf  [C0603]  17.14 35.81 180 top
C14  0.1uF  [C0603]  74.54 38.26 270 top
C17  10uf  [C0603]  47.37 38.73 270 top
C18  10nf  [C0603]  17.46 19.62 180 top
C19  10pf  [C0603]  47.5 18.54 0 top
C20  10pf  [C0603]  50.8 18.54 180 top
C30  10uF  [C0603]  61.82 35.52 180 top
C31  100nF  [C0603]  61.82 33.75 180 top
C32  100nF  [C0603]  69.02 38.32 270 top
C33  10uF  [C0603]  70.92 38.32 270 top
CN1  ZX-PZ2.54-2-5PZZ  [HDR-TH_10P-P2.54-V-M-R2-C5-S2.54]  21.72 41.53 180 top
H2  2.54-1*4P反弯排针  [HDR-TH_4P-P2.54-H-M-W10.4]  5.33 7.62 270 top
LED1  -  [LED_0603]  3.3 41.15 180 top
LED2  -  [LED_0603]  3.3 42.93 180 top
LED6  KT-0603R  [LED0603-RD]  73.83 42.64 0 top
LED7  NCD0603B1  [LED0603-RD]  73.87 40.88 0 top
Q1  DW01  [SOT-23-6_L2.9-W1.6-P0.95-LS2.8-BR]  77.78 38.96 0 top
Q4  -  [S8050_SOT-23]  50.73 38.03 270 top
Q5  FS8205A  [SOT-23-6_L2.9-W1.6-P0.95-LS2.8-BR]  82.15 38.95 0 top
Q6  2N3904(SOT-23)  [sot-23-3_l2.9-w1.3-p1.90-ls2.4-br]  11.43 30.61 180 top
R1  10K  [R0603]  76.47 29.59 270 top
R2  10K  [R0603]  81.15 24 180 top
R3  10K  [R0603]  34.69 30.14 0 top
R4  4.7k  [R0603]  6.7 41.17 0 top
R5  4.7k  [R0603]  6.71 42.91 0 top
R9  1K  [R0603]  75.29 35.9 0 top
R10  100  [R0603]  72.74 38.31 270 top
R12  20Ω  [R0603]  41.04 41.4 0 top
R13  20Ω  [R0603]  50.11 40.6 180 top
R14  1K  [R0603]  49.21 33.58 0 top
R15  10K  [R0603]  49.15 35.18 0 top
R18  1k  [R0603]  11.16 26.54 180 top
R19  10k  [R0603]  11.18 28.07 0 top
R26  2kΩ  [R0603]  61.72 43.45 180 top
R27  10kΩ  [R0603]  70.43 42.64 0 top
R28  10kΩ  [R0603]  70.46 40.85 0 top
R29  4.7K  [R0603]  38.74 35.81 180 top
R30  4.7K  [R0603]  38.74 37.47 180 top
SW3  -  [Key_SMD_3x4x2]  80.41 20.24 90 top
SW4  -  [Key_SMD_3x4x2]  80.99 28.26 90 top
U1  GD32VF103R8T6  [LQFP-64_L10.0-W10.0-P0.50-LS12.0-BL]  37.21 22.35 90 top
U2  AMS1117-3.3  [SOT-223-3_L6.5-W3.4-P2.30-LS7.0-BR]  11 37.25 180 top
U4  HS096T01H13  [LCD-SMD_HS096T01H13]  44.58 37.85 180 top
U5  CH340C  [SOP-16_L10.0-W3.9-P1.27-LS6.0-BL]  12.11 20.4 90 top
U11  TP4056  [esop-8_l4.9-w3.9-p1.27-ls6.0-bl-ep]  63.92 39.33 270 top
USB1  TYPE-C 6P  [TYPE-C-SMD_TYPE-C-6P]  3.6 33 270 top
USB2  TYPEC-304J-BCP16  [USB-C-SMD_TYPEC-304J-BCP16]  4 21 270 top
X1  8MHz  [HC-49S_L10.8-W4.5-P4.88]  58.2 23.1 90 top
X2  32.768kHz  [CRYSTAL-SMD_L3.2-W1.5]  49.28 16.26 0 top

## Footprints (pads in the part's own frame, mm; a bottom-side part is the same pattern mirrored in y, then rotated)
BAT-SMD_CR1220-2ZX
  rect 4.5x2.3 smd: 1(-8.6,0) 2(8.6,0)
BUZ
  rect 1.5x1.5 hole 0.9: 1(0,0)
  round 1.5 hole 0.9: 2(6,0)
C0603
  rect 0.8x0.9 smd: 1(-0.7,0) 2(0.7,0)
CRYSTAL-SMD_L3.2-W1.5
  rect 1.3x1.8 smd: 1(-1.458,0) 2(1.458,0)
esop-8_l4.9-w3.9-p1.27-ls6.0-bl-ep
  rect 0.6x1.2 smd: 1(-1.905,-2.909) 2(-0.635,-2.909) 3(0.635,-2.909) 4(1.905,-2.909) 5(1.905,2.909) 6(0.635,2.909) 7(-0.635,2.909) 8(-1.905,2.909)
  rect 3.3x2.4 smd: 9(0,0)
HC-49S_L10.8-W4.5-P4.88
  round 1.8 hole 0.9: 1(-2.44,0) 2(2.44,0)
HDR-TH_4P-P2.54-H-M-W10.4
  rect 1.8x1.8 hole 1.1: 1(-3.81,0)
  round 1.8 hole 1.1: 2(-1.27,0) 3(1.27,0) 4(3.81,0)
HDR-TH_10P-P2.54-V-M-R2-C5-S2.54
  rect 1.7x1.7 hole 1.1: 1(-5.08,-1.27)
  round 1.7 hole 1.1: 2(-5.08,1.27) 3(-2.54,-1.27) 4(-2.54,1.27) 5(0,-1.27) 6(0,1.27) 7(2.54,-1.27) 8(2.54,1.27) 9(5.08,-1.27) 10(5.08,1.27)
Key_SMD_3x4x2
  rect 1.53x1.36 smd: 1(-2.035,0) 2(2.035,0)
LCD-SMD_HS096T01H13
  rect 3x0.5 smd: 1(0,4.2) 2(0,3.5) 3(0,2.8) 4(0,2.1) 5(0,1.4) 6(0,0.7) 7(0,0) 8(0,-0.7) 9(0,-1.4) 10(0,-2.1) 11(0,-2.8) 12(0,-3.5) 13(0,-4.2)
LED0603-RD
  rect 0.8x0.8 smd: 1(-0.799,-0.004) 2(0.799,0.004)
LED_0603
  rect 0.8x0.8 smd: 1(-0.851,-0.01) 2(0.75,-0.005)
LQFP-64_L10.0-W10.0-P0.50-LS12.0-BL
  oval 0.3x2 smd: 1(-3.75,-5.75) 2(-3.25,-5.75) 3(-2.75,-5.75) 4(-2.25,-5.75) 5(-1.75,-5.75) 6(-1.25,-5.75) 7(-0.75,-5.75) 8(-0.25,-5.75) 9(0.25,-5.75) 10(0.75,-5.75) 11(1.25,-5.75) 12(1.75,-5.75) 13(2.25,-5.75) 14(2.75,-5.75) 15(3.25,-5.75) 16(3.75,-5.75) 33(3.75,5.75) 34(3.25,5.75) 35(2.75,5.75) 36(2.25,5.75) 37(1.75,5.75) 38(1.25,5.75) 39(0.75,5.75) 40(0.25,5.75) 41(-0.25,5.75) 42(-0.75,5.75) 43(-1.25,5.75) 44(-1.75,5.75) 45(-2.25,5.75) 46(-2.75,5.75) 47(-3.25,5.75) 48(-3.75,5.75)
  oval 2x0.3 smd: 17(5.75,-3.75) 18(5.75,-3.25) 19(5.75,-2.75) 20(5.75,-2.25) 21(5.75,-1.75) 22(5.75,-1.25) 23(5.75,-0.75) 24(5.75,-0.25) 25(5.75,0.25) 26(5.75,0.75) 27(5.75,1.25) 28(5.75,1.75) 29(5.75,2.25) 30(5.75,2.75) 31(5.75,3.25) 32(5.75,3.75) 49(-5.75,3.75) 50(-5.75,3.25) 51(-5.75,2.75) 52(-5.75,2.25) 53(-5.75,1.75) 54(-5.75,1.25) 55(-5.75,0.75) 56(-5.75,0.25) 57(-5.75,-0.25) 58(-5.75,-0.75) 59(-5.75,-1.25) 60(-5.75,-1.75) 61(-5.75,-2.25) 62(-5.75,-2.75) 63(-5.75,-3.25) 64(-5.75,-3.75)
R0603
  rect 0.806x0.864 smd: 1(-0.753,0) 2(0.753,0)
S8050_SOT-23
  rect 1x0.8 smd: 1(1.15,-0.823) 2(1.15,1.077) 3(-1.15,0.127)
SOP-16_L10.0-W3.9-P1.27-LS6.0-BL
  oval 0.56x1.745 smd: 1(-4.445,-2.873) 2(-3.175,-2.873) 3(-1.905,-2.873) 4(-0.635,-2.873) 5(0.635,-2.873) 6(1.905,-2.873) 7(3.175,-2.873) 8(4.445,-2.873) 9(4.445,2.873) 10(3.175,2.873) 11(1.905,2.873) 12(0.635,2.873) 13(-0.635,2.873) 14(-1.905,2.873) 15(-3.175,2.873) 16(-4.445,2.873)
sot-23-3_l2.9-w1.3-p1.90-ls2.4-br
  rect 1.25x0.7 smd: 1(1,-0.95) 2(1,0.95) 3(-1,0)
SOT-23-6_L2.9-W1.6-P0.95-LS2.8-BR
  rect 1.1x0.6 smd: 1(1.35,-0.95) 2(1.35,0) 3(1.35,0.95) 4(-1.35,0.95) 5(-1.35,0) 6(-1.35,-0.95)
SOT-223-3_L6.5-W3.4-P2.30-LS7.0-BR
  rect 2.5x1.1 smd: 1(2.97,-2.3) 2(2.97,0) 3(2.97,2.3)
  rect 2.34x3.6 smd: 4(-2.97,0)
TYPE-C-SMD_TYPE-C-6P
  oval 1.1x1.9 hole 0.7x1.5: 7(-4.32,1.837) 7(-4.32,-1.962) 7(4.32,1.837) 7(4.32,-1.962)
  rect 0.7x1 smd: A5(-0.5,1.962) A9(1.5,1.962) B5(0.5,1.962) B9(-1.5,1.962)
  rect 0.8x1 smd: A12(2.7,1.962) B12(-2.7,1.962)
USB-C-SMD_TYPEC-304J-BCP16
  oval 1x2.1 hole 0.6x1.8: 13(-4.325,1.718) 14(4.325,1.718)
  oval 1x1.9 hole 0.6x1.5: 15(-4.325,-2.482) 16(4.325,-2.482)
  rect 0.6x1.15 smd: A1B12(-3.2,2.482) A4B9(-2.4,2.482) B1A12(3.2,2.482) B4A9(2.4,2.482)
  rect 0.3x1.15 smd: A5(-1.25,2.482) A6(-0.25,2.482) A7(0.25,2.482) A8(1.25,2.482) B5(1.75,2.482) B6(0.75,2.482) B7(-0.75,2.482) B8(-1.75,2.482)

## Nets
As in the schematic.

Pads without a net: CN1 10; Q1 4; U1 8 9 10 11 14 15 16 22 26 27 29 30 33 34 35 36 37 38 39 40 41 44 45 46 51 53 54 55 56 57 58 59 61 62; U4 1 2 9; U5 7 8 9 10 11 12 13 14 15; USB1 A5 B5; USB2 A5 A8 B5 B8

## Via types
v1: diameter 0.61, hole 0.305, Top Layer to Bottom Layer, 44 vias

## Routing (per net, layer and track width the routed paths; a pad name or vN(x,y) marks a point on that pad's centre or on a via; arc(x,y) is an arc through that point)
+5V: length 136.7
  Top Layer w0.254: 3.58,23.03 3.66,23.11 5.46,23.11 5.75,23.4 USB2.A4B9
  Top Layer w0.508: C30.2 60.83,35.81 58.42,35.81 ; 16.64,42.8 16.38,43.05 v1(14.88,43.05) 12.19,43.05 11.68,42.55 11.68,35.31 11.43,35.05 v1(9.91,35.05) ; U5.16 7.95,15.95 ; 7.95,15.95 7.75,16.16 7.75,18.29 7.44,18.6 USB2.B4A9 ; 7.95,15.95 7.57,15.95 6.86,15.24 3.94,15.24 3.58,15.6 3.58,31.49 ; 3.58,31.49 3.58,31.5 USB1.A9 ; 3.58,31.49 3.58,33.99 4.09,34.5 USB1.B9 ; 65.57,43.73 65.79,43.94 74.55,43.94 74.63,43.86 LED6.2 74.63,40.92 LED7.2 ; 65.57,43.73 65.57,43.78 v1(65.53,43.81) ; 65.57,43.73 65.41,43.56 65.41,41.4 65.57,41.24 66.82,41.24 ; 61.12,33.75 61.08,33.78 58.67,33.78 58.22,34.24 58.22,37.52 ; 58.22,37.52 v1(58.22,44.32) ; 58.22,37.52 58.31,37.43 U11.4
  Bottom Layer w0.508: v1(65.53,43.81) 65.02,44.32 v1(58.22,44.32) 15.49,44.32 14.88,43.71 v1(14.88,43.05)
  vias: v1(9.91,33.81)
GND: length 37.5
  Top Layer w0.254: U1.18 v1(40.46,26.54) ; C18.1 18.16,20.32 18.16,20.33 v1(18.16,21.46) ; v1(43.81,14.48) 43.03,14.48 43.01,14.45 C3.1 ; C4.1 32.51,16.44 32.51,17.78 33.15,18.42 39.88,18.42 40.46,17.83 U1.63 40.46,15.44 39.75,14.73 v1(39.75,13.72) ; U1.12 v1(40.64,24.1) ; U5.1 v1(18.16,15.95)
  Bottom Layer w0.254: v1(43.81,14.48) 43.81,13.97 43.56,13.72 v1(39.75,13.72) ; v1(40.46,26.54) 40.46,24.28 v1(40.64,24.1) ; v1(18.16,15.95) v1(18.16,21.46)
VCC: length 237
  Top Layer w0.254: U1.32 33.46,29.02 33.27,29.21 32.38,29.21 32.2,29.4 C2.2 ; U1.19 39.96,31.45 v1(40.26,31.75) ; v1(44.96,18.6) U1.1 41.46,18.6 40.96,18.1 U1.64 40.96,14.46 C3.2 v1(40.95,12.95) ; U1.13 44.92,24.6 v1(44.96,24.64) 46.13,24.64 46.28,24.48 ; C4.2 30.92,16.26 29.84,16.26 29.46,16.64 v1(29.46,17.46) 29.46,18.35 29.71,18.6 U1.48
  Top Layer w0.508: v1(76.45,26.42) 76.47,26.43 R1.2 ; C17.1 46.86,39.95 U4.10 40.44,39.95 40.28,40.11 R12.1 38.61,41.4 37.98,40.78 R30.2 R29.2 32.38,35.81 32.13,35.56 v1(32.13,32.8) 32.2,32.73 C2.2 ; U2.2 10.25,37.25 v1(10.29,37.21) 10.29,37.97 9.91,38.35 3.56,38.35 2.55,39.36 LED1.2 LED2.2 ; v1(14.93,34.92) 14.93,33.51 15.37,33.08 18.22,33.08 BUZ1.1 v1(23.24,32.8) ; 19.18,42.8 19.3,42.67 19.3,38.99 19.05,38.73 v1(15.88,38.73) ; v1(80.41,20.32) SW3.1 80.41,9.38 v1(80.52,9.27) ; H2.1 v1(11.81,11.43)
  Bottom Layer w0.254: v1(29.46,17.46) 29.46,9.5 29.7,9.27 ; 40.97,9.27 40.95,9.29 v1(40.95,12.95) ; v1(44.96,18.6) v1(44.96,24.64) 44.96,31.37 44.45,31.88 40.39,31.88 v1(40.26,31.75)
  Bottom Layer w0.508: v1(40.26,31.75) 36.96,31.75 35.91,32.8 v1(32.13,32.8) v1(23.24,32.8) ; v1(76.45,26.42) 76.45,20.7 76.84,20.32 v1(80.41,20.32) ; v1(11.81,11.43) 17.91,11.43 20.07,9.27 v1(80.52,9.27) ; v1(10.29,37.21) 13.21,37.21 13.59,36.83 v1(13.59,34.92)
BAT+: length 68.9
  Top Layer w0.254: BT3.1 36.23,10.7 36.83,11.3 v1(64.39,11.3) ; C32.2 69.02,37.61 68.84,37.43 65.97,37.43 65.92,37.38 64.69,37.38 64.39,37.08 v1(64.39,13.46) ; C32.2 69.72,37.62 69.79,37.55 72.74,37.55 ; C32.2 69.02,37.68
  Bottom Layer w0.254: v1(64.39,11.3) v1(64.39,13.46)
BAT-: length 65.3
  Top Layer w0.254: Q5.1 83.47,37.97 82.09,37.97 81.91,37.79 81.91,35.81 82.17,35.56 83.19,35.56 83.44,35.31 83.44,5.84 82.3,4.7 53.43,4.7
BLK: length 20
  Top Layer w0.254: R14.1 47.68,33.58 47.5,33.4 47.5,32.77 46.94,32.21 41.73,32.21 41.53,32 41.53,26.42 40.89,25.78 37.85,25.78 37.46,26.17 U1.24
BOOT0: length 56.6
  Top Layer w0.254: R2.2 80.4,22.28 SW3.2 78.92,22.28 78.61,21.97 78.61,13.33 77.47,12.19 39.37,12.19 38.96,12.6 U1.60
BOOT1: length 2
  Top Layer w0.254: U1.28 35.45,28.11 R3.2
BUZ: length 37.6
  Top Layer w0.254: R18.1 13.72,26.54 v1(13.84,26.42) ; U1.52 34.96,14.51 34.42,13.97 14.22,13.97 v1(13.84,14.35)
  Bottom Layer w0.254: v1(13.84,14.35) v1(13.84,26.42)
CS: length 14.8
  Top Layer w0.254: v1(41.02,34.29) 39.75,34.29 39.46,34 U1.20 ; v1(41.15,37.98) 41.28,37.85 U4.7
  Bottom Layer w0.254: v1(41.02,34.29) 41.15,34.42 v1(41.15,37.98)
D1/D2: length 2.7
  Top Layer w0.254: Q5.5 Q5.2
DP+: length 12
  Top Layer w0.254: 7.75,20.25 7.75,21.08 7.58,21.25 USB2.A6 ; 7.75,20.25 7.94,20.45 10.16,20.45 10.8,19.81 13.21,19.81 13.46,20.07 13.46,20.83 13.72,21.08 13.81,21.08 13.86,21.03 U5.5 ; 7.75,20.25 USB2.B6
DP-: length 12
  Top Layer w0.254: USB2.A7 5.41,20.75 5.29,20.87 5.29,21.23 5.82,21.77 6.47,21.77 USB2.B7 7.14,21.75 7.18,21.7 14.65,21.7 14.99,22.03 U5.6
LED_K: length 4.8
  Top Layer w0.254: R13.2 49.31,40.65 U4.11
NRST: length 46.4
  Top Layer w0.254: v1(65.53,30.48) 65.67,30.34 R1.1 77.16,30.34 77.2,30.3 SW4.2 ; U1.7 51.45,21.6 51.82,21.97 51.82,29.84 52.45,30.48 v1(63.25,30.48)
  Bottom Layer w0.254: v1(63.25,30.48) v1(65.53,30.48)
OSC32_IN: length 8.3
  Top Layer w0.254: X2.1 48.2,16.64 C19.2 48.2,18.86 47.45,19.6 U1.3
OSC32_OUT: length 10.9
  Top Layer w0.254: X2.2 50.1,16.89 C20.2 50.1,19.5 49.53,20.07 44.25,20.07 44.22,20.1 U1.4
OSC_IN: length 15.3
  Top Layer w0.254: X1.1 58.1,20.56 C5.2 54.21,20.56 54.18,20.6 U1.5
OSC_OUT: length 19.2
  Top Layer w0.254: U1.6 53.87,21.1 54.74,21.97 C6.2 55.44,25.59 55.49,25.54 58.2,25.54
PA9: length 65.2
  Top Layer w0.254: 26.8,40.26 26.8,21.72 ; H2.3 2.67,6.35 1.91,7.11 1.91,14.1 2.16,14.35 11.68,14.35 12.19,14.86 12.19,18.03 12.57,18.42 19.56,18.42 20.07,18.92 20.07,21.3 20.32,21.56 31.42,21.56 U1.42
PA10: length 63.6
  Top Layer w0.254: H2.2 12.06,8.89 12.83,9.65 12.83,17.02 13.08,17.27 20.45,17.27 v1(20.74,17.57) 20.74,20.8 21.07,21.12 31.44,21.12 U1.43 ; v1(24.38,23.11) 24.38,40.13 CN1.4
  Bottom Layer w0.254: v1(24.38,23.11) 24.38,17.91 24.05,17.57 v1(20.74,17.57)
PC13: length 62.4
  Top Layer w0.254: U1.2 33.86,19.1 33.4,19.56 33.4,26.54 33.15,26.8 29.59,26.8 29.21,27.18 29.21,43.31 28.07,44.45 9.65,44.45 9.14,43.94 9.14,41.4 8.91,41.17 R4.2
RES: length 16.5
  Top Layer w0.254: v1(42.16,37.08) 42.23,37.15 U4.6 ; U1.25 v1(36.96,33.4)
  Bottom Layer w0.254: v1(36.96,33.4) 41.91,33.4 42.16,33.66 v1(42.16,37.08)
RS: length 16.4
  Top Layer w0.254: U4.5 44.63,36.5 46.81,36.5 46.99,36.32 46.99,33.02 46.61,32.64 41.28,32.64 40.96,32.33 U1.17
SCL: length 17.2
  Top Layer w0.254: U1.21 38.96,33.9 v1(38.83,34.04) ; R30.1 40.63,37.47 40.76,37.34 40.77,37.34 41.02,37.08 41.02,36.58 41.85,35.75 U4.4
  Bottom Layer w0.254: v1(40.51,37.47) 38.86,37.47 38.83,37.43 v1(38.83,34.04)
SDA: length 14.3
  Top Layer w0.254: U4.3 41.66,35.05 40.89,35.81 R29.1 39.49,35.04 39.12,34.67 38.23,34.67 37.96,34.41 U1.23
SWCLK: length 34.9
  Top Layer w0.254: v1(28.19,20.32) 28.19,15.62 28.57,15.24 33.15,15.24 33.46,15.55 U1.49 ; v1(28.19,22.48) 28.19,42.29 27.69,42.8 26.8,42.8
  Bottom Layer w0.254: v1(28.19,22.48) v1(28.19,20.32)
SWDIO: length 39
  Top Layer w0.254: 24.26,42.8 25.02,42.8 25.53,42.29 v1(25.53,22.48) ; U1.50 33.96,14.78 33.78,14.61 26.29,14.61 25.53,15.37 v1(25.53,20.19)
  Bottom Layer w0.254: v1(25.53,22.48) v1(25.53,20.19)
$1N3244: length 1.8
  Top Layer w0.254: LED1.1 5.94,41.16 5.95,41.17
$1N3260: length 1.8
  Top Layer w0.254: R5.1 5.93,42.94 LED2.1
$1N3280: length 5.8
  Top Layer w0.254: R9.2 77.43,35.9 77.72,36.19 77.72,38.61 78.1,38.99 79.1,38.99 Q1.2
$1N3281: length 3.7
  Top Layer w0.254: Q1.5 C14.1 74.44,39.06 R10.1
$1N3299: length 2.8
  Top Layer w0.254: R12.2 44.52,41.4 U4.12
$1N3320: length 1.4
  Top Layer w0.254: R13.1 50.86,39.18 Q4.3
$1N3321: length 3.3
  Top Layer w0.254: R14.2 49.9,33.64 R15.2 49.9,36.87 Q4.1
$1N3342: length 2.5
  Top Layer w0.254: C18.2 16.75,19.64 14.22,19.64
$1N3364: length 6.6
  Top Layer w0.254: R26.2 60.95,43.43 59.56,43.43 59.26,43.13 59.26,40.15 59.44,39.97 U11.2
$1N3367: length 5.2
  Top Layer w0.254: R27.1 69.02,42.64 68.99,42.67 68.07,42.67 67.73,42.33 67.73,40.22 67.48,39.97 66.82,39.97
$1N3368: length 1.9
  Top Layer w0.254: LED6.1 73.03,42.64 R27.2
$1N3369: length 1.8
  Top Layer w0.254: 71.34,40.98 72.97,40.98 LED7.1
$1N3370: length 5
  Top Layer w0.254: R28.1 69.58,40.85 69.41,41.02 68.45,41.02 68.25,40.82 68.25,39.01 67.94,38.7 66.82,38.7
$1N3387: length 1.7
  Top Layer w0.254: Q1.1 80.79,38.01 Q5.6
$1N3388: length 1.7
  Top Layer w0.254: Q5.4 79.14,39.9 Q1.3
$1N22478: length 7.1
  Top Layer w0.254: Q6.2 9.46,29.66 9.02,29.21 9.02,27.99 ; R18.2 10.28,26.42 9.27,26.42 9.02,26.67 9.02,27.99 ; 9.02,27.99 9.09,28.07 R19.1
$1N22491: length 9.8
  Top Layer w0.254: Q6.3 18.29,30.61 18.41,30.48 18.41,26.88 BUZ1.2

## Copper pours and planes (outline as drawn; the poured copper is in the pictures)
+5V on Top Layer: 9.76,32.62 10.41,33.27 10.41,35.56 9.91,36.07 6.98,36.07 6.48,35.56 6.48,35.43 6.22,35.18 5.08,35.18 4.8,34.9 4.8,34.06 4.83,34.04 5.97,34.04 6.1,33.91 6.1,32.81 6.29,32.62
GND on Top Layer: -2.54,46.61 86.11,46.61 86.11,-1.91 -2.54,-1.91
GND on Bottom Layer: -7.62,49.53 88.77,49.53 88.77,-5.97 -7.62,-5.97
VCC on Top Layer: 12.3,39.29 12.57,39.55 16.45,39.55 17.27,38.73 17.27,34.92 16.76,34.42 12.83,34.42 12.3,34.94

Small or netless copper shapes (teardrops, artwork), in the pictures only: 186 on Top Layer, 46 on Bottom Layer
